# Altium project Cortex.PrjPCB
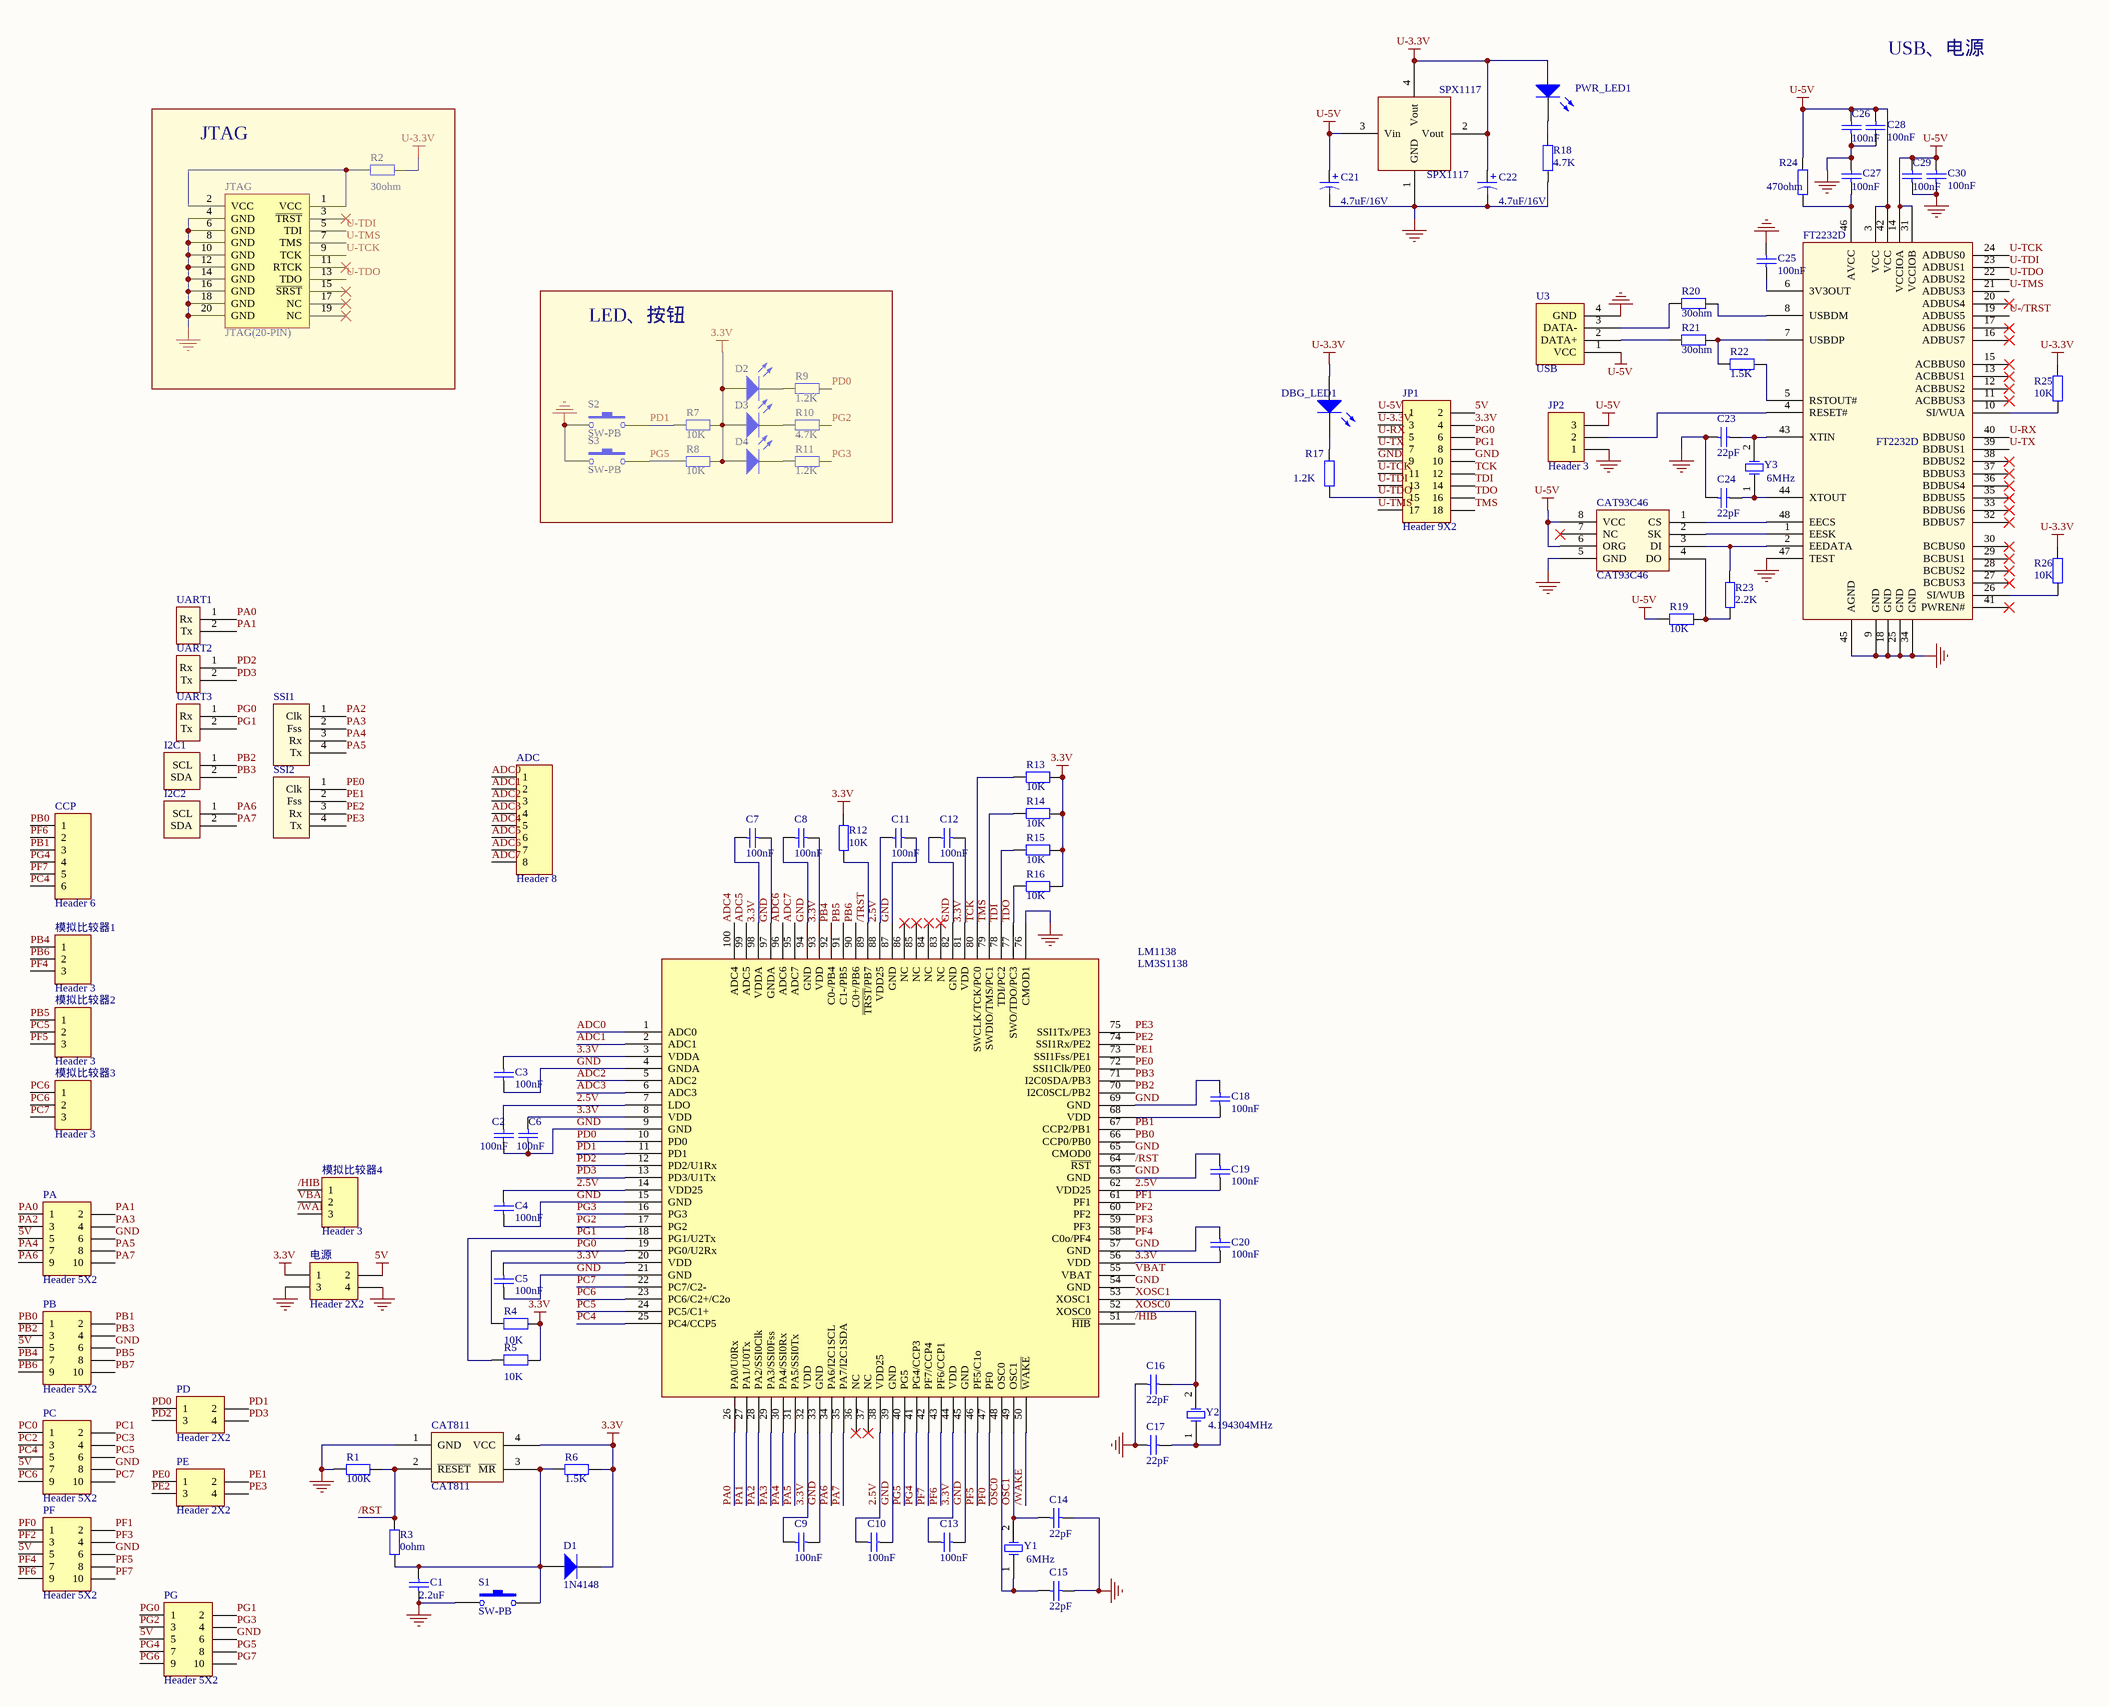
[diagram p0: Cortex.SchDoc]
1 sheet, 98 parts. Net scope: global (net labels, ports and power ports of the same name join across sheets).
Board file: Cortex.PcbDoc

## Sheet Cortex.SchDoc: LM1138(Coretex-M3)核心板
size A2; DrawnBy: Athurg Gooth

### Parts
ADC  Header 8  [HDR1X8]
C1  value 2.2uF  [C0805]  (hidden comment: Cap)
C2  value 100nF  [C0805]  (hidden comment: Cap)
C3  value 100nF  [C0805]  (hidden comment: Cap)
C4  value 100nF  [C0805]  (hidden comment: Cap)
C5  value 100nF  [C0805]  (hidden comment: Cap)
C6  value 100nF  [C0805]  (hidden comment: Cap)
C7  value 100nF  [C0805]  (hidden comment: Cap)
C8  value 100nF  [C0805]  (hidden comment: Cap)
C9  value 100nF  [C0805]  (hidden comment: Cap)
C10  value 100nF  [C0805]  (hidden comment: Cap)
C11  value 100nF  [C0805]  (hidden comment: Cap)
C12  value 100nF  [C0805]  (hidden comment: Cap)
C13  value 100nF  [C0805]  (hidden comment: Cap)
C14  value 22pF  [C0805]  (hidden comment: Cap)
C15  value 22pF  [C0805]  (hidden comment: Cap)
C16  value 22pF  [C0805]  (hidden comment: Cap)
C17  value 22pF  [C0805]  (hidden comment: Cap)
C18  value 100nF  [C0805]  (hidden comment: Cap)
C19  value 100nF  [C0805]  (hidden comment: Cap)
C20  value 100nF  [C0805]  (hidden comment: Cap)
C21  value 4.7uF/16V  [C1206]  (hidden comment: Cap Pol1)
C22  value 4.7uF/16V  [C1206]  (hidden comment: Cap Pol1)
C23  value 22pF  [C0805]  (hidden comment: Cap)
C24  value 22pF  [C0805]  (hidden comment: Cap)
C25  value 100nF  [C0805]  (hidden comment: Cap)
C26  value 100nF  [C0805]  (hidden comment: Cap)
C27  value 100nF  [C0805]  (hidden comment: Cap)
C28  value 100nF  [C0805]  (hidden comment: Cap)
C29  value 100nF  [C0805]  (hidden comment: Cap)
C30  value 100nF  [C0805]  (hidden comment: Cap)
CAT93C46  CAT93C46  [SO8]
CAT811  CAT811  [SOT-143]
CCP  Header 6  [HDR1X6]
D1  1N4148  [DO-35]
D2  LED2  [3.2X1.6X1.1]  (value not drawn)
D3  LED2  [3.2X1.6X1.1]  (value not drawn)
D4  LED2  [3.2X1.6X1.1]  (value not drawn)
DBG_LED1  LED0  [LED-0]  (value not drawn)
FT2232D  FT2232D  [LQFP-48]
I2C1  I2C  [HDR1X2]  (value not drawn)
I2C2  I2C  [HDR1X2]  (value not drawn)
JP1  Header 9X2  [HDR2X9]
JP2  Header 3  [HDR1X3]
JTAG  JTAG(20-PIN)  [IDC-20(2.54)IDE]
LM1138  LM3S1138  [LQFP-100]
PA  Header 5X2  [HDR2X5]
PB  Header 5X2  [HDR2X5]
PC  Header 5X2  [HDR2X5]
PD  Header 2X2  [HDR2X2]
PE  Header 2X2  [HDR2X2]
PF  Header 5X2  [HDR2X5]
PG  Header 5X2  [HDR2X5]
PWR_LED1  LED0  [LED-0]  (value not drawn)
R1  value 100K  [C0805]  (hidden comment: Res2)
R2  value 30ohm  [C0805]  (hidden comment: Res2)
R3  value 0ohm  [C0805]  (hidden comment: Res2)
R4  value 10K  [C0805]  (hidden comment: Res2)
R5  value 10K  [C0805]  (hidden comment: Res2)
R6  value 1.5K  [C0805]  (hidden comment: Res2)
R7  value 10K  [C0805]  (hidden comment: Res2)
R8  value 10K  [C0805]  (hidden comment: Res2)
R9  value 1.2K  [C0805]  (hidden comment: Res2)
R10  value 4.7K  [C0805]  (hidden comment: Res2)
R11  value 1.2K  [C0805]  (hidden comment: Res2)
R12  value 10K  [C0805]  (hidden comment: Res2)
R13  value 10K  [C0805]  (hidden comment: Res2)
R14  value 10K  [C0805]  (hidden comment: Res2)
R15  value 10K  [C0805]  (hidden comment: Res2)
R16  value 10K  [C0805]  (hidden comment: Res2)
R17  value 1.2K  [C0805]  (hidden comment: Res2)
R18  value 4.7K  [C0805]  (hidden comment: Res2)
R19  value 10K  [C0805]  (hidden comment: Res2)
R20  value 30ohm  [C0805]  (hidden comment: Res2)
R21  value 30ohm  [C0805]  (hidden comment: Res2)
R22  value 1.5K  [C0805]  (hidden comment: Res2)
R23  value 2.2K  [C0805]  (hidden comment: Res2)
R24  value 470ohm  [C0805]  (hidden comment: Res2)
R25  value 10K  [C0805]  (hidden comment: Res2)
R26  value 10K  [C0805]  (hidden comment: Res2)
S1  SW-PB  [SPST-2]
S2  SW-PB  [SPST-2]
S3  SW-PB  [SPST-2]
SPX1117  SPX1117  [SOT223]
SSI1  SSI  [HDR1X4]  (value not drawn)
SSI2  SSI  [HDR1X4]  (value not drawn)
U3  USB  [USB-B]
UART1  UART  [HDR1X2]  (value not drawn)
UART2  UART  [HDR1X2]  (value not drawn)
UART3  UART  [HDR1X2]  (value not drawn)
Y1  6MHz  [R38]
Y2  4.194304MHz  [R38]
Y3  6MHz  [R38]
模拟比较器1  Header 3  [HDR1X3]
模拟比较器2  Header 3  [HDR1X3]
模拟比较器3  Header 3  [HDR1X3]
模拟比较器4  Header 3  [HDR1X3]
电源  Header 2X2  [HDR2X2]

### Blocks framed on the sheet
JTAG: JTAG R2
LED、按钮: D2-D4 R7-R11 S2 S3

### Nets
3.3V: C3.2 C5.2 C6.2 C7.2 C8.1 C9.2 C12.1 C13.1 C20.2 CAT811.4(VCC) D1.2(K) D2.1(A) D3.1(A) D4.1(A) JP1.4 LM1138.3(VDDA) LM1138.8(VDD) LM1138.20(VDD) LM1138.32(VDD) LM1138.44(VDD) LM1138.56(VDD) LM1138.81(VDD) LM1138.93(VDD) LM1138.98(VDDA) R4.2 R5.2 R6.2 R7.2 R8.2 R12.2 R13.1 R14.1 R15.1 R16.1 电源.1
5V: JP1.2 PA.5 PB.5 PC.7 PF.5 PG.5 电源.2
GND: C1.1 C2.1 C3.1 C4.1 C5.1 C6.1 C7.1 C8.2 C9.1 C10.2 C11.1 C12.2 C13.2 C14.2 C15.2 C16.1 C17.1 C18.1 C19.1 C20.1 C21.2 C22.2 C23.1 C24.1 C25.2 C26.2 C27.1 C28.2 C29.2 C30.2 CAT93C46.5(GND) CAT811.1(GND) FT2232D.9(GND) FT2232D.18(GND) FT2232D.25(GND) FT2232D.34(GND) FT2232D.45(AGND) FT2232D.47(TEST) JP1.9 JP1.10 JP2.1 JTAG.4(GND) JTAG.6(GND) JTAG.8(GND) JTAG.10(GND) JTAG.12(GND) JTAG.14(GND) JTAG.16(GND) JTAG.18(GND) JTAG.20(GND) LM1138.4(GNDA) LM1138.9(GND) LM1138.15(GND) LM1138.21(GND) LM1138.33(GND) LM1138.39(GND) LM1138.45(GND) LM1138.54(GND) LM1138.57(GND) LM1138.63(GND) LM1138.65(CMOD0) LM1138.69(GND) LM1138.76(CMOD1) LM1138.82(GND) LM1138.87(GND) LM1138.94(GND) LM1138.97(GNDA) PA.6 PB.6 PC.8 PF.6 PG.6 R1.2 R18.2 S1.1 S2.1 S3.1 SPX1117.1(GND) U3.4(GND) 电源.3 电源.4
U-3.3V: C22.1 DBG_LED1.1(A) JP1.3 PWR_LED1.1(A) R2.2 R25.2 R26.2 SPX1117.2(Vout) SPX1117.4(Vout)
U-5V: C21.1 C26.1 C28.1 C29.1 C30.1 CAT93C46.6(ORG) CAT93C46.8(VCC) FT2232D.3(VCC) FT2232D.14(VCCIOA) FT2232D.31(VCCIOB) FT2232D.42(VCC) JP1.1 JP2.3 R19.2 R24.2 SPX1117.3(Vin) U3.1(VCC)
2.5V: C2.2 C4.2 C10.1 C11.2 C19.2 LM1138.7(LDO) LM1138.14(VDD25) LM1138.38(VDD25) LM1138.62(VDD25) LM1138.88(VDD25)
/HIB: LM1138.51(~{HIB}) 模拟比较器4.1
/RST: CAT811.2(~{RESET}) LM1138.64(~{RST}) R1.1 R3.1
/TRST: LM1138.89(~{TRST}/PB7) R12.1
/WAKE: LM1138.50(~{WAKE}) 模拟比较器4.3
ADC0: ADC.1 LM1138.1(ADC0)
ADC1: ADC.2 LM1138.2(ADC1)
ADC2: ADC.3 LM1138.5(ADC2)
ADC3: ADC.4 LM1138.6(ADC3)
ADC4: ADC.5 LM1138.100(ADC4)
ADC5: ADC.6 LM1138.99(ADC5)
ADC6: ADC.7 LM1138.96(ADC6)
ADC7: ADC.8 LM1138.95(ADC7)
OSC0: C15.1 LM1138.48(OSC0) Y1.1(OSC1)
OSC1: C14.1 LM1138.49(OSC1) Y1.2(OSC2)
PA0: LM1138.26(PA0/U0Rx) PA.1 UART1.1(Rx)
PA1: LM1138.27(PA1/U0Tx) PA.2 UART1.2(Tx)
PA2: LM1138.28(PA2/SSI0Clk) PA.3 SSI1.1(Clk)
PA3: LM1138.29(PA3/SSI0Fss) PA.4 SSI1.2(Fss)
PA4: LM1138.30(PA4/SSI0Rx) PA.7 SSI1.3(Rx)
PA5: LM1138.31(PA5/SSI0Tx) PA.8 SSI1.4(Tx)
PA6: I2C2.1(SCL) LM1138.34(PA6/I2C1SCL) PA.9
PA7: I2C2.2(SDA) LM1138.35(PA7/I2C1SDA) PA.10
PB0: CCP.1 LM1138.66(CCP0/PB0) PB.1
PB1: CCP.3 LM1138.67(CCP2/PB1) PB.2
PB2: I2C1.1(SCL) LM1138.70(I2C0SCL/PB2) PB.3
PB3: I2C1.2(SDA) LM1138.71(I2C0SDA/PB3) PB.4
PB4: LM1138.92(C0-/PB4) PB.7 模拟比较器1.1
PB5: LM1138.91(C1-/PB5) PB.8 模拟比较器2.1
PB6: LM1138.90(C0+/PB6) PB.9 模拟比较器1.2
PB7: PB.10
PC0: PC.1
PC1: PC.2
PC2: PC.3
PC3: PC.4
PC4: CCP.6 LM1138.25(PC4/CCP5) PC.5
PC5: LM1138.24(PC5/C1+) PC.6 模拟比较器2.2
PC6: LM1138.23(PC6/C2+/C2o) PC.9 模拟比较器3.1 模拟比较器3.2
PC7: LM1138.22(PC7/C2-) PC.10 模拟比较器3.3
PD0: LM1138.10(PD0) PD.1 R9.2
PD1: LM1138.11(PD1) PD.2 R7.1 S2.2
PD2: LM1138.12(PD2/U1Rx) PD.3 UART2.1(Rx)
PD3: LM1138.13(PD3/U1Tx) PD.4 UART2.2(Tx)
PE0: LM1138.72(SSI1Clk/PE0) PE.1 SSI2.1(Clk)
PE1: LM1138.73(SSI1Fss/PE1) PE.2 SSI2.2(Fss)
PE2: LM1138.74(SSI1Rx/PE2) PE.3 SSI2.3(Rx)
PE3: LM1138.75(SSI1Tx/PE3) PE.4 SSI2.4(Tx)
PF0: LM1138.47(PF0) PF.1
PF1: LM1138.61(PF1) PF.2
PF2: LM1138.60(PF2) PF.3
PF3: LM1138.59(PF3) PF.4
PF4: LM1138.58(C0o/PF4) PF.7 模拟比较器1.3
PF5: LM1138.46(PF5/C1o) PF.8 模拟比较器2.3
PF6: CCP.2 LM1138.43(PF6/CCP1) PF.9
PF7: CCP.5 LM1138.42(PF7/CCP4) PF.10
PG0: JP1.6 LM1138.19(PG0/U2Rx) PG.1 R4.1 UART3.1(Rx)
PG1: JP1.8 LM1138.18(PG1/U2Tx) PG.2 R5.1 UART3.2(Tx)
PG2: LM1138.17(PG2) PG.3 R10.2
PG3: LM1138.16(PG3) PG.4 R11.2
PG4: CCP.4 LM1138.41(PG4/CCP3) PG.7
PG5: LM1138.40(PG5) PG.8 R8.1 S3.2
PG6: PG.9
PG7: PG.10
TCK: JP1.12 LM1138.80(SWCLK/TCK/PC0) R13.2
TDI: JP1.14 LM1138.78(TDI/PC2) R15.2
TDO: JP1.16 LM1138.77(SWO/TDO/PC3) R16.2
TMS: JP1.18 LM1138.79(SWDIO/TMS/PC1) R14.2
U-/TRST: FT2232D.19(ADBUS5)
U-RX: FT2232D.40(BDBUS0) JP1.5
U-TCK: FT2232D.24(ADBUS0) JP1.11 JTAG.9(TCK)
U-TDI: FT2232D.23(ADBUS1) JP1.13 JTAG.5(TDI)
U-TDO: FT2232D.22(ADBUS2) JP1.15 JTAG.13(TDO) R17.1
U-TMS: FT2232D.21(ADBUS3) JP1.17 JTAG.7(TMS)
U-TX: FT2232D.39(BDBUS1) JP1.7
VBAT: LM1138.55(VBAT) 模拟比较器4.2
XOSC0: C16.2 LM1138.52(XOSC0) Y2.2(OSC2)
XOSC1: C17.2 LM1138.53(XOSC1) Y2.1(OSC1)
NetC1_2: C1.2 CAT811.3(~{MR}) D1.1(A) R3.2 R6.1 S1.2
NetC18_2: C18.2 LM1138.68(VDD)
NetC23_2: C23.2 FT2232D.43(XTIN) Y3.2(OSC2)
NetC24_2: C24.2 FT2232D.44(XTOUT) Y3.1(OSC1)
NetC25_1: C25.1 FT2232D.6(3V3OUT)
NetC27_2: C27.2 FT2232D.46(AVCC) R24.1
NetCAT93C46_1: CAT93C46.1(CS) FT2232D.48(EECS)
NetCAT93C46_2: CAT93C46.2(SK) FT2232D.1(EESK)
NetCAT93C46_3: CAT93C46.3(DI) FT2232D.2(EEDATA) R23.1
NetCAT93C46_4: CAT93C46.4(DO) R19.1 R23.2
NetD2_2: D2.2(K) R9.1
NetD3_2: D3.2(K) R10.1
NetD4_2: D4.2(K) R11.1
NetDBG_LED1_2: DBG_LED1.2(K) R17.2
NetFT2232D_4: FT2232D.4(RESET#) JP2.2
NetFT2232D_5: FT2232D.5(RSTOUT#) R22.1
NetFT2232D_7: FT2232D.7(USBDP) R21.1 R22.2
NetFT2232D_8: FT2232D.8(USBDM) R20.1
NetFT2232D_10: FT2232D.10(SI/WUA) R25.1
NetFT2232D_26: FT2232D.26(SI/WUB) R26.1
NetJTAG_1: JTAG.1(VCC) JTAG.2(VCC) R2.1
NetPWR_LED1_2: PWR_LED1.2(K) R18.1
NetR20_2: R20.2 U3.3(DATA-)
NetR21_2: R21.2 U3.2(DATA+)

Not connected (* = marked no-connect by the designer): CAT93C46 7(NC)*; FT2232D 11(ACBBUS3)* 12(ACBBUS2)* 13(ACBBUS1)* 15(ACBBUS0)* 16(ADBUS7)* 17(ADBUS6)* 20(ADBUS4)* 27(BCBUS3)* 28(BCBUS2)* 29(BCBUS1)* 30(BCBUS0)* 32(BDBUS7)* 33(BDBUS6)* 35(BDBUS5)* 36(BDBUS4)* 37(BDBUS3)* 38(BDBUS2)* 41(PWREN#)*; JTAG 3(~{TRST})* 11(RTCK)* 15(~{SRST})* 17(NC)* 19(NC)*; LM1138 36(NC)* 37(NC)* 83(NC)* 84(NC)* 85(NC)* 86(NC)*; U3 5(NC) 6(NC)

### Notes on the sheet
- USB、电源

### Library data of the parts
ADC = Header 8: Header, 8-Pin; LatestRevisionDate: 17-Jul-2002; LatestRevisionNote: Re-released for DXP Platform.; Publisher: Altium Limited
C1-C20 C23-C30 = Cap: Capacitor; Published: 8-Jun-2000; LatestRevisionDate: 17-Jul-2002; LatestRevisionNote: Re-released for DXP Platform.; PackageReference: C0805; Publisher: Altium Limited
C21 C22 = Cap Pol1: Polarized Capacitor (Radial); Published: 8-Jun-2000; LatestRevisionDate: 17-Jul-2002; LatestRevisionNote: Re-released for DXP Platform.; PackageReference: RB7.6-15; Publisher: Altium Limited
CCP = Header 6: Header, 6-Pin; LatestRevisionDate: 17-Jul-2002; LatestRevisionNote: Re-released for DXP Platform.; Publisher: Altium Limited
D1 = Diode 1N4148: High Conductance Fast Diode; Published: 8-Jun-2000; LatestRevisionDate: 17-Jul-2002; LatestRevisionNote: Re-released for DXP Platform.; DatasheetDocument: 1997; PackageReference: DO-35; Publisher: Altium Limited; Code_JEDEC: DO-204-AH; ComponentLink1Description: Manufacturer Link; ComponentLink1URL: http://www.fairchildsemi.com/; ComponentLink2Description: Datasheet; ComponentLink2URL: http://www.fairchildsemi.com/ds/1N%2F1N4148.pdf
D2-D4 = LED2: Typical RED, GREEN, YELLOW, AMBER GaAs LED; Published: 8-Jun-2000; LatestRevisionDate: 17-Jul-2002; LatestRevisionNote: Re-released for DXP Platform.; PackageDocument: Feb-2002; PackageReference: 3.2X1.6X1.1; Publisher: Altium Limited
DBG_LED1 PWR_LED1 = LED0: Typical INFRARED GaAs LED; Published: 8-Jun-2000; LatestRevisionDate: 08-Jul-2005; LatestRevisionNote: Mech Layer 1 removed.; PackageReference: LED-0; Publisher: Altium Limited
JP1 = Header 9X2: Header, 9-Pin, Dual row; LatestRevisionDate: 17-Jul-2002; LatestRevisionNote: Re-released for DXP Platform.; Publisher: Altium Limited
JP2 模拟比较器1-模拟比较器4 = Header 3: Header, 3-Pin; LatestRevisionDate: 17-Jul-2002; LatestRevisionNote: Re-released for DXP Platform.; Publisher: Altium Limited
PA PB PC PF PG = Header 5X2: Header, 5-Pin, Dual row; LatestRevisionDate: 17-Jul-2002; LatestRevisionNote: Re-released for DXP Platform.; Publisher: Altium Limited
PD PE 电源 = Header 2X2: Header, 2-Pin, Dual row; LatestRevisionDate: 17-Jul-2002; LatestRevisionNote: Re-released for DXP Platform.; Publisher: Altium Limited
R1-R26 = Res2: Resistor; Published: 8-Jun-2000; LatestRevisionDate: 17-Jul-2002; LatestRevisionNote: Re-released for DXP Platform.; PackageReference: AXIAL-0.4; Publisher: Altium Limited
S1-S3 = SW-PB: Switch; Published: 24-Mar-1999; LatestRevisionDate: 17-Jul-2002; LatestRevisionNote: Re-released for DXP Platform.; PackageReference: SPST-2; Publisher: Altium Limited
Y1-Y3 = XTAL: Crystal Oscillator; Published: 8-Jun-2000; LatestRevisionDate: 17-Jul-2002; LatestRevisionNote: Re-released for DXP Platform.; PackageReference: R38; Publisher: Altium Limited